# EAGLE design board_single_full1 (EAGLE 7.7.0)
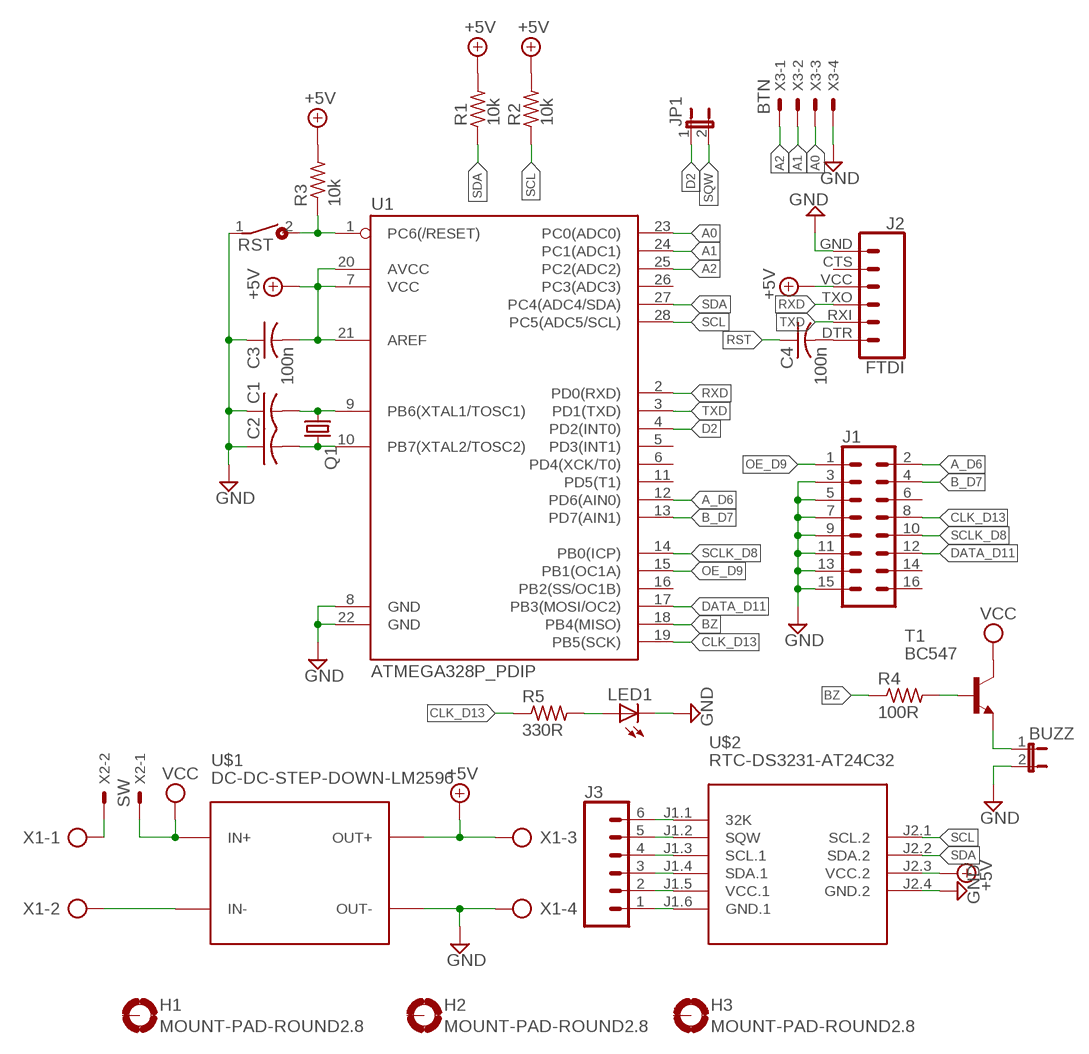
[diagram p0: schematic, sheet 1]

## Parts
BUZZ  JP1E  [JP1]
C1  C-USC0603K  [C0603K]
C2  C-USC0603K  [C0603K]
C3  100n  C-USC0603K  [C0603K]
C4  100n  C-USC0603K  [C0603K]
H1  MOUNT-PAD-ROUND2.8  [2,8-PAD]
H2  MOUNT-PAD-ROUND2.8  [2,8-PAD]
H3  MOUNT-PAD-ROUND2.8  [2,8-PAD]
J1  CONN_08X2_SHROUD  [2X8-SHROUDED_LOCK]
J2  FTDI  6_PIN_SERIAL_CABLEPTH  [FTDI_BASIC]
J3  CONN_06NO_SILK_FEMALE_PTH  [1X06_NO_SILK]
JP1  JP1E  [JP1]
LED1  LED3MM  [LED3MM]
Q1  CRYSTALHC49U-V  [HC49U-V]
R1  10k  R-US_0207/7  [0207/7]
R2  10k  R-US_0207/7  [0207/7]
R3  10k  R-US_R0603  [R0603]
R4  100R  R-US_R0603  [R0603]
R5  330R  R-US_R0603  [R0603]
RST  DS01E  [DS-01]
T1  BC547  [TO92]
U1  ATMEGA328P_PDIP  [DIL28-3]
U$1  DC-DC-STEP-DOWN-LM2596  [DC-DC-STEP-DOWN-LM2596]
U$2  RTC-DS3231-AT24C32  [RTC-DS3231-AT24C32]
X1  AK500/4  [AK500/4]
X2  SW  JST-XH-02-PIN-LONG-PAD  [JST-XH-02-PACKAGE-LONG-PAD]
X3  BTN  JST-XH-04-PIN-LONG-PAD  [JST-XH-04-PACKAGE-LONG-PAD]

## Nets
+5V: C3.2 J2.VCC R1.2 R2.2 R3.2 U1.7(VCC) U1.20(AVCC) U1.21(AREF) U$1.OUT+ U$2.J2.3(VCC.2) X1.3
A0: U1.23(PC0(ADC0)) X3.3
A1: U1.24(PC1(ADC1)) X3.2
A2: U1.25(PC2(ADC2)) X3.1
A_D6: J1.2 U1.12(PD6(AIN0))
B_D7: J1.4 U1.13(PD7(AIN1))
BZ: R4.1 U1.18(PB4(MISO))
CLK_D13: J1.8 R5.1 U1.19(PB5(SCK))
D2: JP1.1 U1.4(PD2(INT0))
DATA_D11: J1.12 U1.17(PB3(MOSI/OC2))
GND: BUZZ.2 C1.1 C2.1 C3.1 J1.3 J1.5 J1.7 J1.9 J1.11 J1.13 J1.15 J2.GND LED1.K(C) RST.1 U1.8(GND) U1.22(GND) U$1.OUT- U$2.J2.4(GND.2) X1.4 X3.4
N$1: X1.1 X2.2
N$2: U$1.IN- X1.2
N$3: BUZZ.1 T1.1(E)
N$4: C1.2 Q1.1 U1.9(PB6(XTAL1/TOSC1))
N$5: C2.2 Q1.2 U1.10(PB7(XTAL2/TOSC2))
N$7: C4.2 J2.DTR
N$8: J3.1 U$2.J1.6(GND.1)
N$9: J3.2 U$2.J1.5(VCC.1)
N$10: J3.3 U$2.J1.4(SDA.1)
N$11: J3.4 U$2.J1.3(SCL.1)
N$12: R4.2 T1.2(B)
N$13: J3.6 U$2.J1.1(32K)
N$14: LED1.A R5.2
OE_D9: J1.1 U1.15(PB1(OC1A))
RST: C4.1 R3.1 RST.2 U1.1(PC6(/RESET))
RXD: J2.TXO U1.2(PD0(RXD))
SCL: R2.1 U1.28(PC5(ADC5/SCL)) U$2.J2.1(SCL.2)
SCLK_D8: J1.10 U1.14(PB0(ICP))
SDA: R1.1 U1.27(PC4(ADC4/SDA)) U$2.J2.2(SDA.2)
SQW: J3.5 JP1.2 U$2.J1.2(SQW)
TXD: J2.RXI U1.3(PD1(TXD))
VCC: T1.3(C) U$1.IN+ X2.1
Unconnected: H1.B2,8(MOUNT) H2.B2,8(MOUNT) H3.B2,8(MOUNT) J1.6 J1.14 J1.16 J2.CTS U1.5(PD3(INT1)) U1.6(PD4(XCK/T0)) U1.11(PD5(T1)) U1.16(PB2(SS/OC1B)) U1.26(PC3(ADC3))

## Library data of the parts
BUZZ JP1 = jumper:JP1E: JUMPER
C1-C4 = CircuitBean:C-US: CAPACITOR, American symbol
H1-H3 = holes:MOUNT-PAD-ROUND: MOUNTING PAD, round
J1 = SparkFun-Connectors:CONN_08X2: Multi connection point. Often used as Generic Header-pin footprint for 0.1 inch spaced/style header connections You can populate with any combo of single row headers, but if you'd like an exact match, check this: Header - 2x8 (Male, 0.1") <https://www.sparkfun.com/products/13156> (PRT-13156) On any of the 0.1 inch spaced packages, you can populate with these: Break Away Headers - Straight <https://www.sparkfun.com/products/116> (PRT-00116) Break Away Male Headers - Right Angle <https://www.sparkfun.com/products/553> (PRT-00553) Female Headers <https://www.sparkfun.com/products/115> (PRT-00115) Break Away Headers - Machine Pin <https://www.sparkfun.com/products/117> (PRT-00117) Break Away Female Headers - Swiss Machine Pin <https://www.sparkfun.com/products/743> (PRT-00743)
J2 = SparkFun-Connectors:6_PIN_SERIAL_CABLE: 6-pin header connection for use with the "FTDI BASIC" pinout - CABLE SIDE. Also known as "Arduino Serial Program Header". This is used on a design to provide a 6-pin connection point for serial communication usually from a USB cable (D+/D-) to these headers (RX/TX). It also has the remaining pins necessary for programming in the Arduino evironment (DTR, GND, and sometimes VCC). Note, this device has "CABLE" in the name. It is intended to be used on a design that usually lives on the end of your USB cable and prvides the converter chip (FTDI232 or FTDI231x) to commnicate serial RX/TX. The "sister" device, named "TARGET" is inteneded to be used on a design that contains a target micro-controller that you wish to program. You can populate with some of these: Female Headers <https://www.sparkfun.com/products/115> (PRT-00115) For reference (or to suit your programming needs) check out these designs: SparkFun FTDI Basic Breakout - 5V <https://www.sparkfun.com/products/9716> (DEV-09716) SparkFun FTDI Basic Breakout - 3.3V <https://www.sparkfun.com/products/9873> (DEV-09873) SparkFun FTDI SmartBasic <https://www.sparkfun.com/products/12935> (DEV-12935) SparkFun Beefy 3 - FTDI Basic Breakout <https://www.sparkfun.com/products/13746> (DEV-13746)
J3 = SparkFun-Connectors:CONN_06: Multi connection point. Often used as Generic Header-pin footprint for 0.1 inch spaced/style header connections On any of the 0.1 inch spaced packages, you can populate with these: Break Away Headers - Straight <https://www.sparkfun.com/products/116> (PRT-00116) Break Away Male Headers - Right Angle <https://www.sparkfun.com/products/553> (PRT-00553) Female Headers <https://www.sparkfun.com/products/115> (PRT-00115) Break Away Headers - Machine Pin <https://www.sparkfun.com/products/117> (PRT-00117) Break Away Female Headers - Swiss Machine Pin <https://www.sparkfun.com/products/743> (PRT-00743) Arduino Stackable Header - 6 Pin <https://www.sparkfun.com/products/9280> (PRT-09280) For SCREWTERMINALS and SPRING TERMINALS visit here: Screw Terimnals on SparkFun.com <https://www.sparkfun.com/search/results?term=Screw+Terminals> (5mm/3.5mm/2.54mm spacing) This device is also useful as a general connection point to wire up your design to another part of your project. Our various solder wires solder well into these plated through hole pads. Hook-Up Wire - Assortment (Stranded, 22 AWG) <https://www.sparkfun.com/products/11375> (PRT-11375) Hook-Up Wire - Assortment (Solid Core, 22 AWG) <https://www.sparkfun.com/products/11367> (PRT-11367) View the entire wire category on our website here <https://www.sparkfun.com/categories/141>; PROD_ID: CONN-08437
LED1 = CircuitBean:LED: LED OSRAM: - CHIPLED LG R971, LG N971, LY N971, LG Q971, LY Q971, LO R971, LY R971 LH N974, LH R974 LS Q976, LO Q976, LY Q976 LO Q996 - Hyper CHIPLED LW Q18S LB Q993, LB Q99A, LB R99A - SideLED LS A670, LO A670, LY A670, LG A670, LP A670 LB A673, LV A673, LT A673, LW A673 LH A674 LY A675 LS A676, LA A676, LO A676, LY A676, LW A676 LS A679, LY A679, LG A679 - Hyper Micro SIDELED® LS Y876, LA Y876, LO Y876, LY Y876 LT Y87S - SmartLED LW L88C, LW L88S LB L89C, LB L89S, LG L890 LS L89K, LO L89K, LY L89K LS L896, LA L896, LO L896, LY L896 - TOPLED LS T670, LO T670, LY T670, LG T670, LP T670 LSG T670, LSP T670, LSY T670, LOP T670, LYG T670 LG T671, LOG T671, LSG T671 LB T673, LV T673, LT T673, LW T673 LH T674 LS T676, LA T676, LO T676, LY T676, LB T676, LH T676, LSB T676, LW T676 LB T67C, LV T67C, LT T67C, LS T67K, LO T67K, LY T67K, LW E67C LS E67B, LA E67B, LO E67B, LY E67B, LB E67C, LV E67C, LT E67C LW T67C LS T679, LY T679, LG T679 LS T770, LO T770, LY T770, LG T770, LP T770 LB T773, LV T773, LT T773, LW T773 LH T774 LS E675, LA E675, LY E675, LS T675 LS T776, LA T776, LO T776, LY T776, LB T776 LHGB T686 LT T68C, LB T68C - Hyper Mini TOPLED® LB M676 - Mini TOPLED Santana® LG M470 LS M47K, LO M47K, LY M47K Source: http://www.osram.convergy.de/
Q1 = CircuitBean:CRYSTAL: CRYSTAL; OC_FARNELL: 1666969; OC_NEWARK: unknown
R1 R2 = resistor:R-US_: RESISTOR, American symbol
R3-R5 = CircuitBean:R-US_: RESISTOR, American symbol
RST = switch-dil:DS01E: DIL/CODE SWITCH; OC_FARNELL: unknown; OC_NEWARK: unknown
T1 = transistor:BC547: NPN TRANSISTOR
U1 = SparkFun-DigitalIC:ATMEGA328P_PDIP: uC used in the Arduino 32kb flash, 1k EEPROM, 2k SRAM This is the through-hole version of this chip.
U$1 = diy-modules_lcd:DC-DC-STEP-DOWN-LM2596: DC/DC Step-Down Regulator based on LM2596-ADJ chip LM2596 datasheet available here: http://www.ti.com/lit/ds/symlink/lm2596.pdf Click here to find device on ebay.com <http://www.ebay.com/sch/lm2596+power+regulator>
U$2 = diy-modules_lcd:RTC-DS3231-AT24C32: RTC Module with Battery and EEPROM based on DS3231 and AT24C32 chips Tutorial can be found here: https://edwardmallon.wordpress.com/2014/05/21/using-a-cheap-3-ds3231-rtc-at24c32-eeprom-from-ebay/ Click here to find device on ebay.com <http://www.ebay.com/sch/DS3231+AT24C32+module>
X1 = con-ptr500:AK500/4: CONNECTOR; OC_FARNELL: unknown; OC_NEWARK: unknown
X2 = JST XH Connectors v1-0:JST-XH-02-PIN: JST XH Connector 2 Pin Wire to board connector. Pitch: 2,54 mm, (0.100") Number of pins: 2 Created by Rembrandt Electronics www.rembrandtelectronics.com
X3 = JST XH Connectors v1-0:JST-XH-04-PIN: JST XH Connector 2 Pin Wire to board connector. Pitch: 2,54 mm, (0.100") Number of pins: 4 Created by Rembrandt Electronics www.rembrandtelectronics.com

## Board
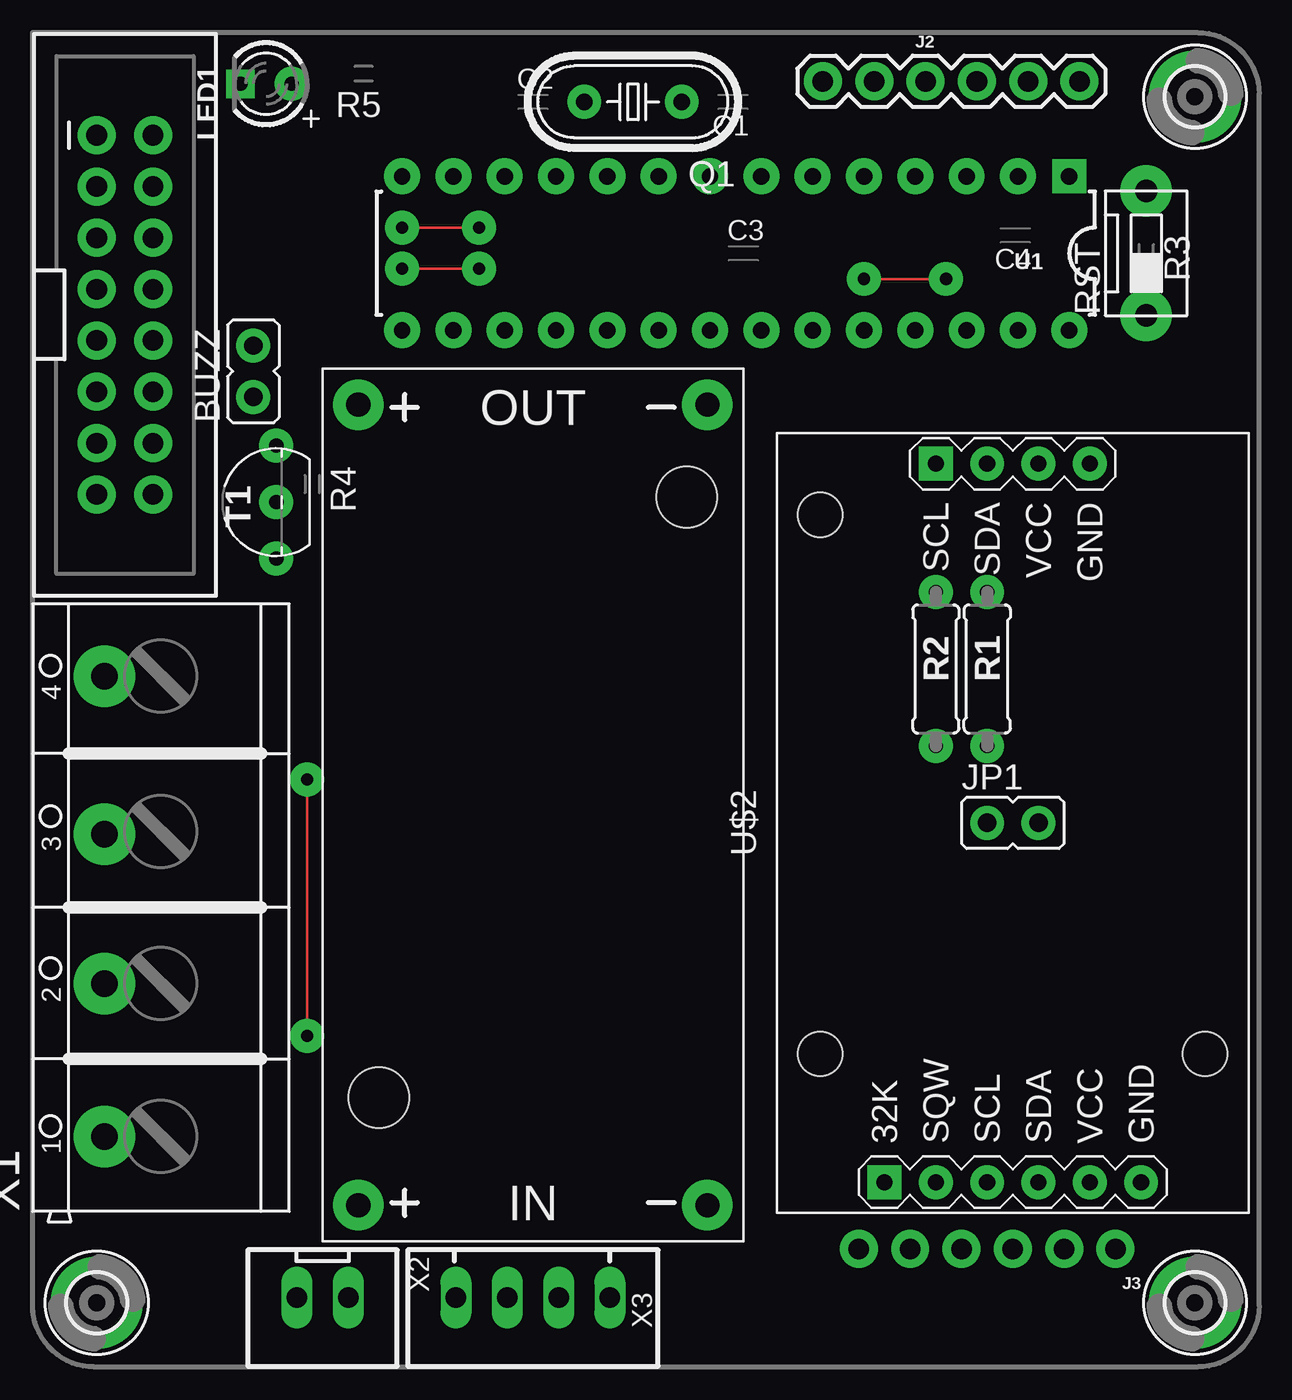
[diagram p1: board, top side]
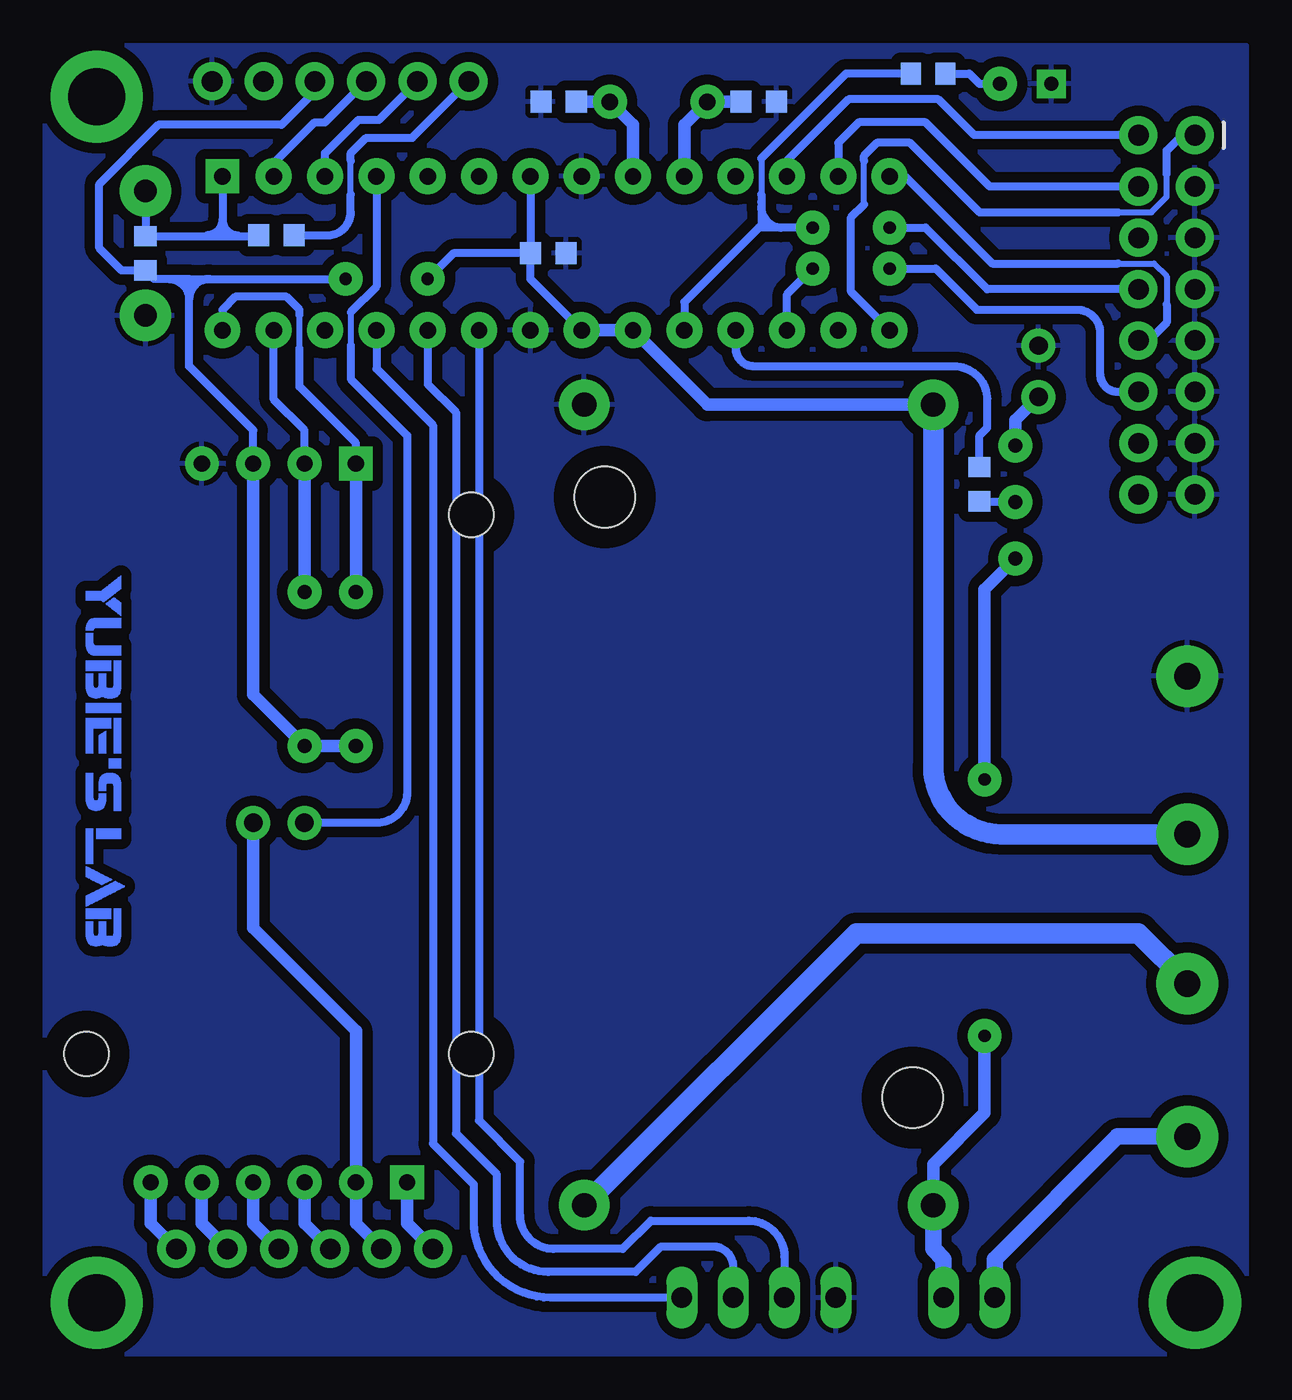
[diagram p2: board, bottom side, seen from below]

No outline drawn. Coordinates in mm, seen from the top.
Copper layers (1*16): Top 0.035mm / dielectric 1.5mm / Bottom 0.035mm
Design rules "default": minimum track width 10mil, minimum drill 24mil, track to track 8mil, track to pad 8mil, pad to pad 8mil, via to via 8mil, smd to smd 8mil, copper to edge 40mil, drill to drill 8mil, minimum pad ring 10mil, minimum via ring 8mil, stop-mask expansion 4mil, vias tented up to drill 0mil, thermal gap 10mil

### Footprints (pad centres in the part's own frame; a part is rotated, then mirrored left to right if it is on the bottom)
JP1 = drill 0.914 pad 1.676: 1 0,-1.27; 2 0,1.27
C0603K = smd 1.05 x 1.08 bottom: 1 -0.875,0; 2 0.875,0
2,8-PAD = drill 2.8 pad 4.572: B2,8 0,0
2X8-SHROUDED_LOCK = drill 1.016 pad 1.88: 1 -1.397,8.89; 2 1.397,8.89; 3 -1.397,6.35; 4 1.397,6.35; 5 -1.397,3.81; 6 1.397,3.81; 7 -1.397,1.27; 8 1.397,1.27; 9 -1.397,-1.27; 10 1.397,-1.27; 11 -1.397,-3.81; 12 1.397,-3.81; 13 -1.397,-6.35; 14 1.397,-6.35; 15 -1.397,-8.89; 16 1.397,-8.89
FTDI_BASIC = drill 1.016 pad 1.88: CTS 10.16,0; DTR 0,0; GND 12.7,0; RXI 2.54,0; TXO 5.08,0; VCC 7.62,0
1X06_NO_SILK = drill 1.016 pad 1.88: 1 0,0; 2 2.54,0; 3 5.08,0; 4 7.62,0; 5 10.16,0; 6 12.7,0
LED3MM = drill 0.7 pad 1.676: A -1.27,0 | drill 0.7 pad 1.422 square: K 1.27,0
HC49U-V = drill 0.813 pad 1.676: 1 -2.413,0; 2 2.413,0
0207/7 = drill 0.7 pad 1.676: 1 -3.81,0; 2 3.81,0
R0603 = smd 1 x 1.1 bottom: 1 -0.85,0; 2 0.85,0
DS-01 = drill 1.1 pad 2.54: 1 0,-3.08; 2 0,3.08
TO92 = drill 0.7 pad 1.676: 1 2.794,0; 2 0,0; 3 -2.794,0
DIL28-3 = drill 0.813 pad 1.676 square: 1 -16.51,-3.81 | drill 0.813 pad 1.778: 2 -13.97,-3.81; 3 -11.43,-3.81; 4 -8.89,-3.81; 5 -6.35,-3.81; 6 -3.81,-3.81; 7 -1.27,-3.81; 8 1.27,-3.81; 9 3.81,-3.81; 10 6.35,-3.81; 11 8.89,-3.81; 12 11.43,-3.81; 13 13.97,-3.81; 14 16.51,-3.81; 15 16.51,3.81; 16 13.97,3.81; 17 11.43,3.81; 18 8.89,3.81; 19 6.35,3.81; 20 3.81,3.81; 21 1.27,3.81; 22 -1.27,3.81; 23 -3.81,3.81; 24 -6.35,3.81; 25 -8.89,3.81; 26 -11.43,3.81; 27 -13.97,3.81; 28 -16.51,3.81
DC-DC-STEP-DOWN-LM2596 = drill 1.2 pad 2.5: IN+ -19.812,8.636; IN- -19.812,-8.636; OUT+ 19.812,8.636; OUT- 19.812,-8.636 | hole 3: -14.478,7.62; 15.24,-7.62
RTC-DS3231-AT24C32 = drill 0.8 pad 1.676 square: J1.1 -17.78,6.35; J2.1 17.78,3.81 | drill 0.8 pad 1.676: J1.2 -17.78,3.81; J1.3 -17.78,1.27; J1.4 -17.78,-1.27; J1.5 -17.78,-3.81; J1.6 -17.78,-6.35; J2.2 17.78,1.27; J2.3 17.78,-1.27; J2.4 17.78,-3.81 | hole 2.2: -11.43,-9.525; -11.43,9.525; 15.24,9.525
AK500/4 = drill 1.3 pad 3.048: 1 -11.328,2.794; 2 -3.759,2.794; 3 3.632,2.794; 4 11.455,2.794
JST-XH-02-PACKAGE-LONG-PAD = drill 1.016 long: 1 -1.27,0; 2 1.27,0
JST-XH-04-PACKAGE-LONG-PAD = drill 1.016 long: 1 -3.81,0; 2 -1.27,0; 3 1.27,0; 4 3.81,0

### Placement (x,y rotation side)
BUZZ  10.92,49.28 0 top
C1  34.67,62.61 180 top
C2  24.77,62.61 0 top
C3  35.18,55.12 0 top
C4  48.64,56.01 180 top
H1  3.17,3.17 0 top
H2  57.53,62.87 0 top
H3  57.53,3.17 0 top
J1  4.57,52.07 0 top
J2  39.12,63.63 0 top
J3  53.59,5.84 180 top
JP1  48.51,26.92 270 top
LED1  11.56,63.5 180 top
Q1  29.72,62.61 180 top
R1  47.24,34.54 270 top
R2  44.7,34.54 270 top
R3  55.12,55.12 270 top
R4  13.84,43.69 270 top
R5  16.38,64.01 180 top
RST  55.12,55.12 0 top
T1  12.06,42.8 90 top
U1  34.8,55.12 180 top
U$1  24.77,27.81 90 top
U$2  48.51,26.92 90 top
X1  6.35,22.73 90 top
X2  14.35,3.43 180 top
X3  24.77,3.43 180 top

### Tracks (layer width: path | path; a pad name or v marks a point on that pad's centre or on a via)
+5V  (via drill 0.6 pad 1.68)
  Top 0.127: v45.21,53.85 v41.15,53.85
  Bottom 0.406: J2.VCC 46.74,63.12 48.39,61.47 54.48,61.47 57.4,58.55 57.4,55.37 56.3,54.27 R3.2 54.7,53.85 53.98,53.85 | C3.2 39.88,55.12 v41.15,53.85 | 52.96,53.85 53.98,53.85 | U1.7 36.07,55.13 C3.2 | U1.21 36.07,53.85 36.07,55.1 C3.2 | U$2.J2.3 49.78,46.35 52.96,49.53 52.96,52.83 | 52.96,52.83 52.96,53.85 | 52.96,53.85 51.94,53.85 | 51.94,53.85 v45.21,53.85 | 51.94,53.85 arc-90 52.96,52.83 | 53.98,53.85 arc90 52.96,52.83
  Bottom 0.61: U1.21 U1.20 27.3,47.62 U$1.OUT+ | U$2.J2.3 49.78,33.27 R1.2 R2.2
  Bottom 1.016: U$1.OUT+ 16.13,29.72 arc-90 12.78,26.36 X1.3
A0
  Bottom 0.406: U1.23 38.61,12.19 36.58,10.16 36.58,7.49 arc-90 34.92,5.84 31.5,5.84 30.1,7.24 25.27,7.24 arc90 23.5,5.46 X3.3
A1
  Bottom 0.406: U1.24 41.15,48.64 39.75,47.24 39.75,11.56 37.72,9.53 37.72,7.24 arc-90 35.18,4.7 30.86,4.7 29.59,5.97 27.05,5.97 arc90 26.04,4.95 X3.2
A2
  Bottom 0.406: U1.25 43.69,49.4 40.89,46.61 40.89,11.05 38.86,9.02 38.86,7.24 arc-90 35.05,3.43 X3.1
A_D6
  Bottom 0.406: J1.2 14.1,60.96 15.88,62.74 20.32,62.74 23.37,59.69 U1.12
B_D7
  Bottom 0.406: U1.13 20.83,60.58 19.81,61.59 16.51,61.59 13.34,58.42 J1.4
BZ
  Bottom 0.406: U1.18 25.91,50.42 arc-90 25.02,49.53 15.11,49.53 arc90 13.46,47.88 13.46,46.48 13.84,46.1 R4.1
CLK_D13  (via drill 0.6 pad 1.68)
  Top 0.127: v22.1,56.39 v18.29,56.39
  Bottom 0.305: 24.64,59.82 24.64,58.04
  Bottom 0.406: J1.8 13.46,53.34 16.51,56.39 v18.29,56.39 | v22.1,56.39 23.62,56.39 | 23.62,56.39 24.64,56.39 | 24.64,56.39 24.77,56.39 28.45,52.7 U1.19 | 24.64,58.04 24.64,57.66 24.64,57.4 | 24.64,57.4 24.64,56.39 | R5.1 20.45,64.01 24.64,59.82 | 24.64,57.4 arc-90 23.62,56.39
D2
  Bottom 0.305: 44.96,52.2 44.96,50.55
  Bottom 0.406: U1.4 43.69,53.47 44.96,52.2 | 44.96,50.55 44.96,48.9 42.16,46.1 42.16,28.45 arc90 43.69,26.92 JP1.1
DATA_D11  (via drill 0.6 pad 1.68)
  Top 0.127: v22.1,54.36 v18.29,54.36
  Bottom 0.406: v18.29,54.36 16,54.36 13.97,52.32 9.02,52.32 arc90 7.87,51.18 7.87,49.15 arc-90 6.99,48.26 J1.12 | U1.17 23.37,53.09 v22.1,54.36
GND
  pour Bottom (isolate 0.508): 3.17,0.64 57.53,0.64 arc90 60.07,3.17 60.07,62.87 arc90 57.53,65.41 0.64,65.41 0.64,3.17 arc90
N$1
  Bottom 0.813: X1.1 7.01,11.4 13.08,5.33 X2.2
N$2
  Bottom 1.016: U$1.IN- 19.94,21.46 5.97,21.46 3.56,19.05 X1.2
N$3
  Bottom 0.61: T1.1 12.06,46.86 BUZZ.1
N$4
  Bottom 0.61: U1.9 30.99,61.47 Q1.1 C1.2
N$5
  Bottom 0.61: U1.10 28.45,61.47 Q1.2 C2.2
N$6
  pour Bottom (isolate 0.508): 3.17,0.64 57.53,0.64 arc90 60.07,3.17 60.07,62.87 arc90 57.53,65.41 0.64,65.41 0.64,3.17 arc90
N$7
  Bottom 0.305: 44.96,58.04 44.96,59.69
  Bottom 0.406: 44.96,59.69 44.96,60.07 44.2,60.83 41.91,60.83 J2.DTR | C4.2 46.1,56.01 arc-90 44.96,57.15 44.96,58.04
N$8
  Bottom 0.61: U$2.J1.6 54.86,7.11 J3.1
N$9
  Bottom 0.61: U$2.J1.5 52.32,7.11 J3.2
N$10
  Bottom 0.61: U$2.J1.4 49.78,7.11 J3.3
N$11
  Bottom 0.61: U$2.J1.3 47.24,7.11 J3.4
N$12
  Bottom 0.406: T1.2 13.8,42.8 R4.2
N$13
  Bottom 0.61: U$2.J1.1 42.16,7.11 J3.6
N$14
  Bottom 0.406: LED1.A 13.84,63.5 14.35,64.01 R5.2
OE_D9
  Bottom 0.305: 19.56,57.53 19.56,59.69 | 6.99,57.15 5.33,57.15 4.57,57.91 4.57,59.05
  Bottom 0.406: U1.15 20.19,53.21 20.19,56.9 19.56,57.53 | 19.56,59.69 19.56,59.94 18.92,60.58 17.27,60.58 13.84,57.15 6.99,57.15 | 4.57,59.05 4.57,60.2 3.81,60.96 J1.1
RST
  Bottom 0.406: 51.27,55.97 R3.1 RST.2 | U1.1 51.31,56.77 | 51.31,56.77 51.31,56.01 51.27,55.97 | 51.27,55.97 49.55,55.97 arc-90 C4.1 | 51.31,56.77 arc90 52.07,56.01 | 51.31,56.77 arc-90 50.55,56.01
RXD
  Bottom 0.406: U1.2 48.77,59.56 46.74,61.59 46.23,61.59 J2.TXO
SCL
  Bottom 0.305: 47.5,50.42 47.5,52.07
  Bottom 0.406: U$2.J2.1 44.7,45.72 47.5,48.51 47.5,50.42 | 47.5,52.07 47.5,52.32 48.13,52.96 50.67,52.96 51.31,52.32 U1.28
  Bottom 0.61: R2.1 U$2.J2.1
SCLK_D8
  Bottom 0.305: 6.99,54.61 5.21,54.61 4.57,53.98 4.57,52.58
  Bottom 0.406: U1.14 17.53,58.93 13.21,54.61 6.99,54.61 | 4.57,52.58 4.57,51.69 5.46,50.8 J1.10
SDA
  Bottom 0.406: U$2.J2.2 47.24,46.35 48.77,47.88 U1.27
  Bottom 0.61: R1.1 U$2.J2.2
SQW
  Bottom 0.61: JP1.2 49.78,21.72 44.7,16.64 U$2.J1.2 44.7,7.11 J3.5
TXD
  Bottom 0.406: U1.3 46.23,60.07 44.58,61.72 43.56,61.72 J2.RXI
VCC  (via drill 0.6 pad 1.68)
  Top 0.127: v13.59,29.08 v13.59,16.38
  Bottom 0.61: T1.3 13.59,38.48 v13.59,29.08 | v13.59,16.38 13.59,12.57 16.13,10.03 U$1.IN+
  Bottom 0.813: X2.1 15.62,5.33 16.13,5.84 U$1.IN+
(copper drawn outside any net)
  shapes: Bottom area x1146

### Text on the board
tDocu: PANEL / P10 | DTR | GND | FTDI | RESET | BUZZER | GND | +5V | SQW EN | -VCC | VCC | SW | BTN